# Altium schematic sheet mcu.SchDoc: Microcontroller
size A4; DrawnBy: Juan I Carrano; DocumentNumber: 3; SheetNumber: 3; SheetTotal: 6
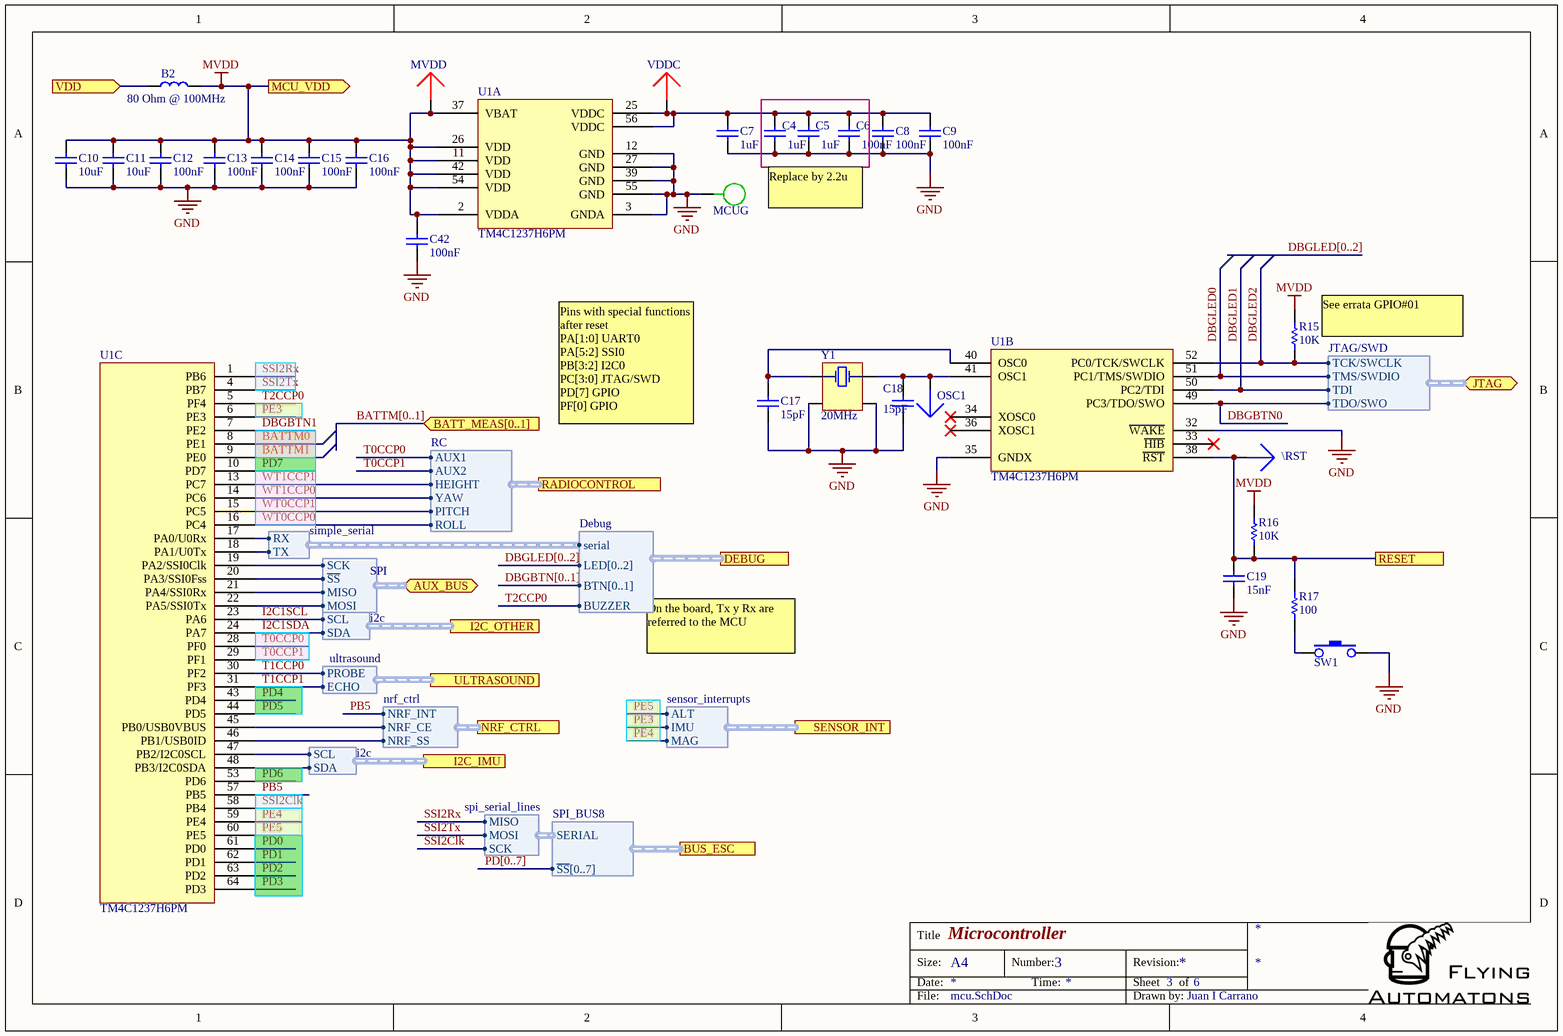
[diagram p0: mcu.SchDoc]

## Parts
\RST  TESTPOINT-ARROW-BLUE  [G-PIN_1mm-CIRCLE]  (value not drawn)
B2  80 Ohm @ 100MHz  [INDC1608L]
C4  1uF  [CAPC1608L]
C5  1uF  [CAPC1608L]
C6  100nF  [CAPC1608L]
C7  1uF  [CAPC1608L]
C8  100nF  [CAPC1608L]
C9  100nF  [CAPC1608L]
C10  10uF  [CAPC3216L]
C11  10uF  [CAPC3216L]
C12  100nF  [CAPC1608L]
C13  100nF  [CAPC1608L]
C14  100nF  [CAPC1608L]
C15  100nF  [CAPC1608L]
C16  100nF  [CAPC1608L]
C17  15pF  [CAPC1608L]
C18  15pF  [CAPC1608L]
C19  15nF  [CAPC1608L]
C42  100nF  [CAPC1608L]
MCUG  TESTPOINT-CIRCLE-GREEN  [G-PIN_1mm-CROSS]  (value not drawn)
MVDD  TESTPOINT-ARROW-RED  [G-PIN_1mm-CIRCLE]  (value not drawn)
OSC1  TESTPOINT-ARROW-BLUE  [G-PIN_1mm-CIRCLE]  (value not drawn)
R15  10K  [RESC1608L]
R16  10K  [RESC1608L]
R17  100  [RESC1608L]
SW1  SWITCH_TACTILE_SPST-2T-NO  [G-SWITCH-M7.1x6.6AS3.25-2T_TH]  (value not drawn)
U1  Manufacturer Part Number: TM4C1237H6PM  [JEDEC_MS-026ACD(D)]  (hidden comment: TM4C1237xxPM)  (parts A,B,C of 3)
VDDC  TESTPOINT-ARROW-RED  [G-PIN_1mm-CIRCLE]  (value not drawn)
Y1  20MHz  [X-EPSO_TSX-3225]

## Ports
AUX_BUS (harness SPI), BATT_MEAS[0..1] (in), BUS_ESC (harness SPI_BUS8), DEBUG (harness Debug), I2C_IMU (harness i2c), I2C_OTHER (harness i2c), JTAG (harness JTAG/SWD), MCU_VDD (out), NRF_CTRL (harness nrf_ctrl), RADIOCONTROL (harness RC), RESET, SENSOR_INT (harness sensor_interrupts), ULTRASOUND (harness ultrasound), VDD (in)

## Harnesses
JTAG/SWD: TCK/SWCLK, TDI, TDO/SWO, TMS/SWDIO
simple_serial: RX, TX
SPI: ~{SS}, MISO, MOSI, SCK
Debug: serial, LED[0..2], BTN[0..1], BUZZER
RC: HEIGHT, ROLL, PITCH, YAW, AUX1, AUX2
SPI_BUS8: SERIAL, ~{SS}[0..7]
sensor_interrupts: ALT, IMU, MAG
i2c: SCL, SDA
ultrasound: PROBE, ECHO
spi_serial_lines: MISO, MOSI, SCK
nrf_ctrl: NRF_SS, NRF_CE, NRF_INT

## Nets
GND: C4.2 C5.2 C6.2 C7.2 C8.2 C9.2 C10.2 C11.2 C12.2 C13.2 C14.2 C15.2 C16.2 C17.2 C18.2 C19.2 C42.2 MCUG.1 SW1.2 U1.3(GNDA) U1.12(GND) U1.27(GND) U1.32(~{WAKE}) U1.35(GNDX) U1.39(GND) U1.55(GND) Y1.2 Y1.4
MVDD: B2.2 C10.1 C11.1 C12.1 C13.1 C14.1 C15.1 C16.1 C42.1 MVDD.1 R15.1 R16.1 U1.2(VDDA) U1.11(VDD) U1.26(VDD) U1.37(VBAT) U1.42(VDD) U1.54(VDD) ; port MCU_VDD
BATTM0: U1.8(PE1)
BATTM1: U1.9(PE0)
DBGBTN0: U1.49(PC3/TDO/SWO) ; port JTAG.TDO/SWO
DBGBTN1: U1.7(PE2)
DBGLED0: U1.51(PC1/TMS/SWDIO) ; port JTAG.TMS/SWDIO
DBGLED1: U1.50(PC2/TDI) ; port JTAG.TDI
DBGLED2: R15.2 U1.52(PC0/TCK/SWCLK) ; port JTAG.TCK/SWCLK
I2C1SCL: U1.23(PA6) ; port I2C_OTHER.SCL
I2C1SDA: U1.24(PA7) ; port I2C_OTHER.SDA
PB5: U1.57(PB5) ; port NRF_CTRL.NRF_INT
PD0: U1.61(PD0)
PD1: U1.62(PD1)
PD2: U1.63(PD2)
PD3: U1.64(PD3)
PD4: U1.43(PD4)
PD5: U1.44(PD5)
PD6: U1.53(PD6)
PD7: U1.10(PD7)
PE3: U1.6(PE3) ; port SENSOR_INT.IMU
PE4: U1.59(PE4) ; port SENSOR_INT.MAG
PE5: U1.60(PE5) ; port SENSOR_INT.ALT
RESET: \RST.1 C19.1 R16.2 R17.1 U1.38(~{RST}) ; port RESET
SSI2Clk: U1.58(PB4) ; harness spi_serial_lines.SCK
SSI2Rx: U1.1(PB6) ; harness spi_serial_lines.MISO
SSI2Tx: U1.4(PB7) ; harness spi_serial_lines.MOSI
T0CCP0: U1.28(PF0) ; port RADIOCONTROL.AUX1
T0CCP1: U1.29(PF1) ; port RADIOCONTROL.AUX2
T1CCP0: U1.30(PF2) ; port ULTRASOUND.PROBE
T1CCP1: U1.31(PF3) ; port ULTRASOUND.ECHO
T2CCP0: U1.5(PF4) ; port DEBUG.BUZZER
VDD: B2.1 ; port VDD
WT0CCP0: U1.16(PC4) ; port RADIOCONTROL.ROLL
WT0CCP1: U1.15(PC5) ; port RADIOCONTROL.PITCH
WT1CCP0: U1.14(PC6) ; port RADIOCONTROL.YAW
WT1CCP1: U1.13(PC7) ; port RADIOCONTROL.HEIGHT
NetC4_1: C4.1 C5.1 C6.1 C7.1 C8.1 C9.1 U1.25(VDDC) U1.56(VDDC) VDDC.1
NetC17_1: C17.1 U1.40(OSC0) Y1.1
NetC18_1: C18.1 OSC1.1 U1.41(OSC1) Y1.3
NetR17_2: R17.2 SW1.1
NetU1_17: U1.17(PA0/U0Rx) ; harness simple_serial.RX
NetU1_18: U1.18(PA1/U0Tx) ; harness simple_serial.TX
NetU1_19: U1.19(PA2/SSI0Clk) ; port AUX_BUS.SCK
NetU1_20: U1.20(PA3/SSI0Fss) ; port AUX_BUS.~{SS}
NetU1_21: U1.21(PA4/SSI0Rx) ; port AUX_BUS.MISO
NetU1_22: U1.22(PA5/SSI0Tx) ; port AUX_BUS.MOSI
NetU1_45: U1.45(PB0/USB0VBUS) ; port NRF_CTRL.NRF_CE
NetU1_46: U1.46(PB1/USB0ID) ; port NRF_CTRL.NRF_SS
NetU1_47: U1.47(PB2/I2C0SCL) ; port I2C_IMU.SCL
NetU1_48: U1.48(PB3/I2C0SDA) ; port I2C_IMU.SDA

Not connected (* = marked no-connect by the designer): U1 33(~{HIB})* 34(XOSC0)* 36(XOSC1)*

## Buses and harness runs
bus BATTM[0..1] = port BATT_MEAS[0..1]
bus DBGBTN[0..1]
bus DBGLED[0..2]
bus PD[0..7]

## Notes on the sheet
- Replace by 2.2u
- (near R15) See errata GPIO#01
- Pins with special functions after reset
  PA[1:0] UART0
  PA[5:2] SSI0
  PB[3:2] I2C0
  PC[3:0] JTAG/SWD
  PD[7] GPIO
  PF[0] GPIO
- On the board, Tx y Rx are referred to the MCU
- Title
- Size:
- Date:
- A4
- Number:
- Time:
- Revision:
- Sheet
- of
- File:
- Drawn by:

## Library data of the parts
\RST OSC1 = TESTP_SIG_1mm: Tespoint; Name: TESTP_SIG_1mm
B2 = FERR_80/100M_0603_600m: FERRITE CHIP 80 OHM 600MA 0603; Manufacturer: Samsung Electro-Mechanics America, Inc; Manufacturer Part Number: CIM10U800NC; Name: FERR_80/100M_0603_600m; Value: 80 Ohm @ 100MHz; Supplier 1: Digi-Key; Supplier Part Number 1: 1276-6386-1-ND
C4 C5 C7 = CAP_1u_0603_25V_X5R_10%: CAP CER 1UF 25V 10% X5R 0603; Manufacturer Part Number: TMK107BJ105KA-T; Name: CAP_1u_0603_25V_X5R_10%; Value: 1uF; Supplier 1: Digi-Key; Supplier Part Number 1: 587-1248-1-ND
C6 C8 C9 C12-C16 C42 = CAP_100n_0603_50V_Y5V: CAP CER 0.1UF 50V Y5V 0603; Manufacturer Part Number: CC0603ZRY5V9BB104; Name: CAP_100n_0603_50V_Y5V; Value: 100nF; Supplier 1: Digi-Key; Supplier Part Number 1: 311-1343-1-ND
C10 C11 = CAP_10u_1206_25V_Y5V: CAP CER 10UF 25V Y5V 1206; Manufacturer Part Number: TMK316F106ZL-T; Name: CAP_10u_1206_25V_Y5V; Value: 10uF; Supplier 1: Digi-Key; Supplier Part Number 1: 587-1353-1-ND
C17 C18 = CAP_15p_0603_50V_NP0_5%: CAP CER 15PF 50V 5% NP0 0603; Manufacturer: Samsung Electro-Mechanics America, Inc; Manufacturer Part Number: CL10C150JB8NCNC; Name: CAP_15p_0603_50V_NP0_5%; Value: 15pF; Supplier 1: Digi-Key; Supplier Part Number 1: 1276-2190-1-ND
C19 = CAP_15n_0603_50V_X7R_10%: CAP CER 0.015UF 50V 10% X7R 0603; Manufacturer Part Number: CL10B153KB8SFNC; Name: CAP_15n_0603_50V_X7R_10%; Value: 15nF; Supplier 1: Digi-Key; Supplier Part Number 1: 1276-1967-1-ND
MCUG = TESTP_GND_GREEN_1mm: Ground Connection; Name: TESTP_GND_GREEN_1mm
MVDD VDDC = TESTP_PWR_1mm: Tespoint for Power Trace; Name: TESTP_PWR_1mm
R15 R16 = RES_10K_0603_0W1_1%: RES 10K OHM 1/10W 5% 0603; Manufacturer Part Number: RC1608J103CS; Name: RES_10K_0603_0W1_1%; Value: 10K; Supplier 1: Digi-Key; Supplier Part Number 1: 1276-5086-1-ND
R17 = RES_100_0603_0W1_1%: RES 100 OHM 1/10W 5% 0603 SMD; Manufacturer Part Number: RC0603JR-07100RL; Name: RES_100_0603_0W1_1%; Value: 100; Supplier 1: Digi-Key; Supplier Part Number 1: 311-100GRCT-ND
SW1 = SW_TACT_7.1x6.6mm_S_A5_TH: SWITCH TACTILE SPST-NO 0.05A 12V; Manufacturer: TE Connectivity; Manufacturer Part Number: 1825027-8; Name: SW_TACT_7.1x6.6mm_S_A5_TH; Supplier 1: Digi-Key; Supplier Part Number 1: 450-1657-ND
U1 = x-TI_TM4C1237H6PM: MCU Tiva C-Series 64 Pin LQFP; Manufacturer: Texas Instruments; Name: x-TI_TM4C1237H6PM
Y1 = XTAL_20M_SMD_9p: CRYSTAL 20MHZ 9PF SMD; Manufacturer: EPSON; Manufacturer Part Number: TSX-3225 20.0000MF20G-AC3; Drawn By: Juan I Carrano; Name: XTAL_20M_SMD_9p; Value: 20MHz; Supplier 1: Digi-Key; Supplier Part Number 1: SER3629CT-ND